# Altium schematic sheet Key_Pull-up.SchDoc
size 49 x 25 mm
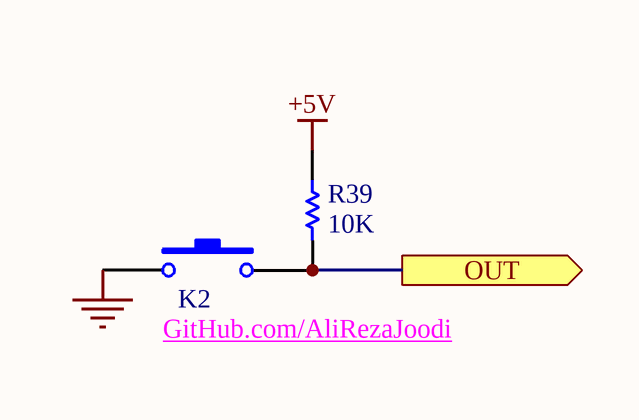
[diagram p0: Key_Pull-up.SchDoc]

## Parts
K2  K2  [SPST-2_2]
R39  R39  value 10K  [AXIAL-0.4]

## Ports
OUT (out)

## Nets
+5V: R39.1
GND: K2.1
OUT: K2.2 R39.2 ; port OUT

## Notes on the sheet
- GitHub.com/AliRezaJoodi

## Library data of the parts
K2 = SW-PB: Switch; Manufacturer: Generic Components; Published: 24-Mar-1999; Revision: July-2002: Re-released for DXP Platform.; Publisher: Altium Limited
R39 = Res1: Resistor; Manufacturer: Generic Components; Class I: Passive; Published: 8-Jun-2000; Revision: July-2002: Re-released for DXP Platform.; Publisher: Altium Limited; Class II: Resistor